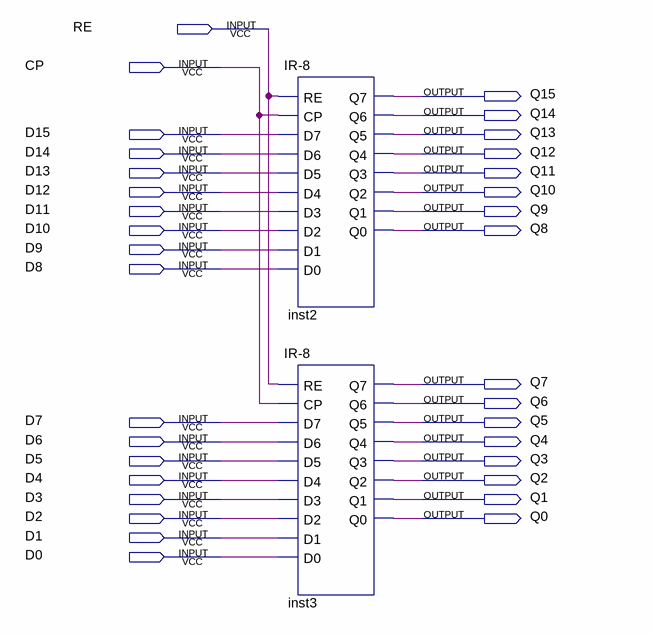
[diagram p0: schematic sheet]
// Quartus schematic IR-16.bdf as structural Verilog: 2 symbols, 34 pins
module \IR-16  (
  input  RE,
  input  CP,
  input  D15,
  input  D14,
  input  D13,
  input  D12,
  input  D11,
  input  D10,
  input  D9,
  input  D8,
  input  D7,
  input  D6,
  input  D5,
  input  D4,
  input  D3,
  input  D2,
  input  D1,
  input  D0,
  output Q15,
  output Q14,
  output Q13,
  output Q12,
  output Q11,
  output Q10,
  output Q9,
  output Q8,
  output Q7,
  output Q6,
  output Q5,
  output Q4,
  output Q3,
  output Q2,
  output Q1,
  output Q0
);

  \IR-8  inst2 (
    .RE(RE), .CP(CP), .D7(D15), .D6(D14), .D5(D13), .D4(D12), .D3(D11), .D2(D10), .D1(D9), .D0(D8), .Q7(Q15),
    .Q6(Q14), .Q5(Q13), .Q4(Q12), .Q3(Q11), .Q2(Q10), .Q1(Q9), .Q0(Q8));
  \IR-8  inst3 (
    .RE(RE), .CP(CP), .D7(D7), .D6(D6), .D5(D5), .D4(D4), .D3(D3), .D2(D2), .D1(D1), .D0(D0), .Q7(Q7),
    .Q6(Q6), .Q5(Q5), .Q4(Q4), .Q3(Q3), .Q2(Q2), .Q1(Q1), .Q0(Q0));
endmodule
